# EAGLE design M710-9601 (EAGLE 6.6.0)
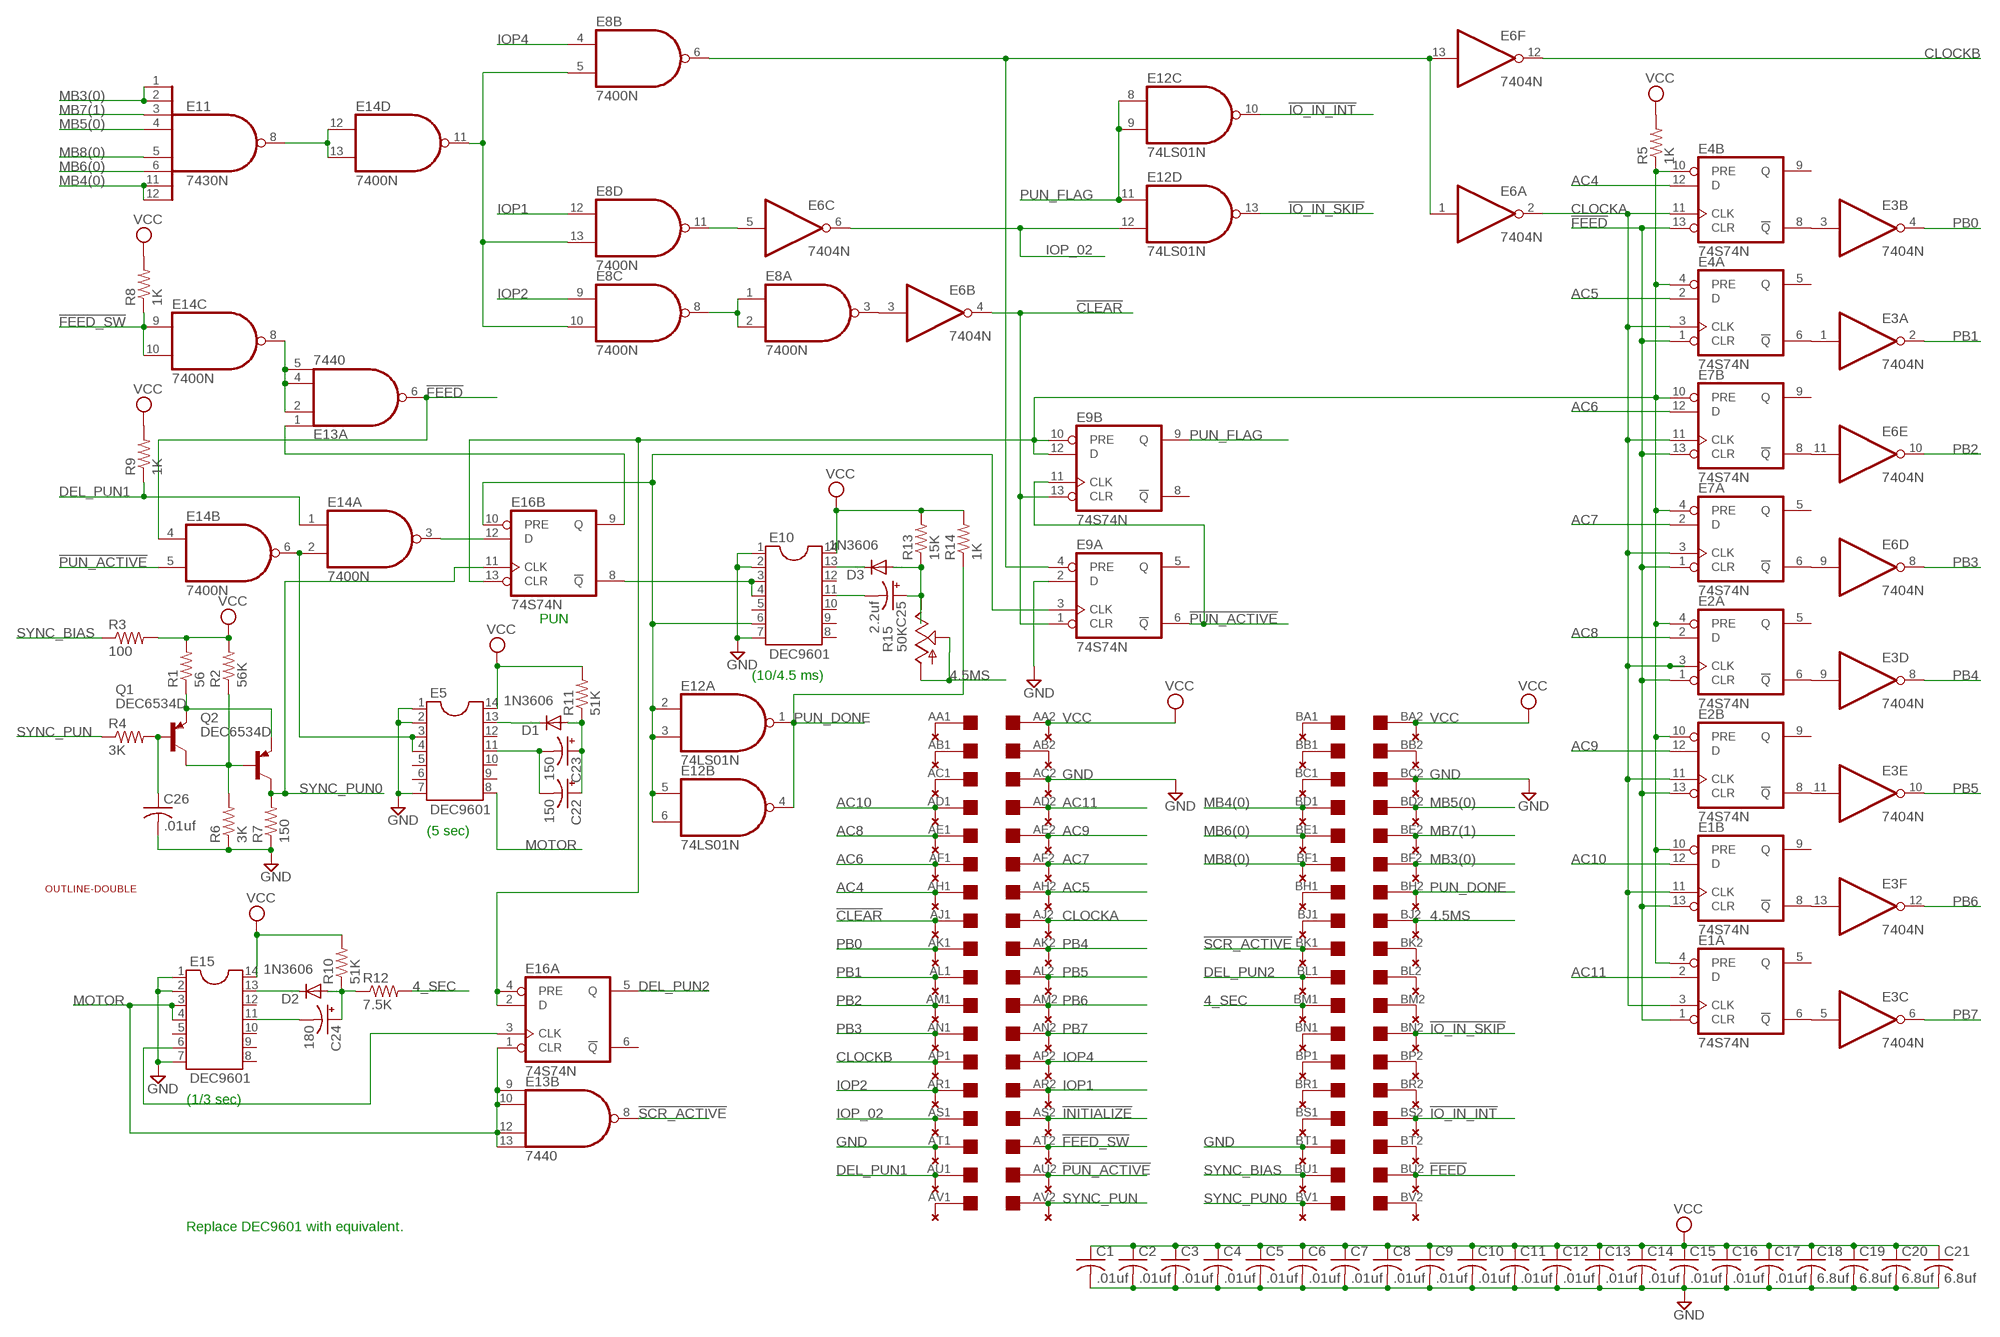
[diagram p0: schematic, sheet 1]

## Parts
C1  .01uf  C-US050-025X075  [C050-025X075]
C2  .01uf  C-US050-025X075  [C050-025X075]
C3  .01uf  C-US050-025X075  [C050-025X075]
C4  .01uf  C-US050-025X075  [C050-025X075]
C5  .01uf  C-US050-025X075  [C050-025X075]
C6  .01uf  C-US050-025X075  [C050-025X075]
C7  .01uf  C-US050-025X075  [C050-025X075]
C8  .01uf  C-US050-025X075  [C050-025X075]
C9  .01uf  C-US050-025X075  [C050-025X075]
C10  .01uf  C-US050-025X075  [C050-025X075]
C11  .01uf  C-US050-025X075  [C050-025X075]
C12  .01uf  C-US050-025X075  [C050-025X075]
C13  .01uf  C-US050-025X075  [C050-025X075]
C14  .01uf  C-US050-025X075  [C050-025X075]
C15  .01uf  C-US050-025X075  [C050-025X075]
C16  .01uf  C-US050-025X075  [C050-025X075]
C17  .01uf  C-US050-025X075  [C050-025X075]
C18  6.8uf  C-US150-054X183  [C150-054X183]
C19  6.8uf  C-US150-054X183  [C150-054X183]
C20  6.8uf  C-US150-054X183  [C150-054X183]
C21  6.8uf  C-US150-054X183  [C150-054X183]
C22  150  CPOL-USE5-8.5  [E5-8,5]
C23  150  CPOL-USE5-8.5  [E5-8,5]
C24  180  CPOL-USE5-8.5  [E5-8,5]
C25  2.2uf  CPOL-USE5-8.5  [E5-8,5]
C26  .01uf  C-US050-025X075  [C050-025X075]
D1  1N3606  1N4004  [DO41-10]
D2  1N3606  1N4004  [DO41-10]
D3  1N3606  1N4004  [DO41-10]
E1  74S74N  [DIL14]
E2  74S74N  [DIL14]
E3  7404N  [DIL14]
E4  74S74N  [DIL14]
E5  DEC9601  DIL14  [DIL14]
E6  7404N  [DIL14]
E7  74S74N  [DIL14]
E8  7400N  [DIL14]
E9  74S74N  [DIL14]
E10  DEC9601  DIL14  [DIL14]
E11  7430N  [DIL14]
E12  74LS01N  [DIL14]
E13  7440  74S20N  [DIL14]
E14  7400N  [DIL14]
E15  DEC9601  DIL14  [DIL14]
E16  74S74N  [DIL14]
Q1  DEC6534D  2N3906  [TO92]
Q2  DEC6534D  2N3906  [TO92]
R1  56  R-US_0207/7  [0207/7]
R2  56K  R-US_0207/7  [0207/7]
R3  100  R-US_0207/7  [0207/7]
R4  3K  R-US_0207/7  [0207/7]
R5  1K  R-US_0207/7  [0207/7]
R6  3K  R-US_0207/7  [0207/7]
R7  150  R-US_0207/7  [0207/7]
R8  1K  R-US_0207/7  [0207/7]
R9  1K  R-US_0207/7  [0207/7]
R10  51K  R-US_0207/7  [0207/7]
R11  51K  R-US_0207/7  [0207/7]
R12  7.5K  R-US_0207/7  [0207/7]
R13  15K  R-US_0207/7  [0207/7]
R14  1K  R-US_0207/7  [0207/7]
R15  50K  TRIM_US-PTSPIN  [PT-SPIN]
U$1  OUTLINE-DOUBLE  [DOUBLE]
U$2  DOUBLE  [EDGE-CON4]
U$5  THRU-HOLE2B  [THRU-HOLEB]
U$7  THRU-HOLE2B  [THRU-HOLEB]

## Nets
4.5MS: R15.A R15.S U$2.BJ2 U$5.J2
4_SEC: R12.2 U$2.BM1 U$5.M1
!CLEAR: E6.4(B:O) E9.1(A:CLR) E9.13(B:CLR) U$2.AJ1 U$7.J1
!FEED: E1.1(A:CLR) E1.13(B:CLR) E2.1(A:CLR) E2.13(B:CLR) E4.1(A:CLR) E4.13(B:CLR) E7.1(A:CLR) E7.13(B:CLR) E13.6(A:O) E14.4(B:I0) U$2.BU2 U$5.U2
!FEED_SW: E14.9(C:I0) E14.10(C:I1) R8.1 U$2.AT2 U$7.T2
!INITIALIZE: U$2.AS2 U$7.S2
!IO_IN_INT: E12.10(C:O) U$2.BS2 U$5.S2
!IO_IN_SKIP: E12.13(D:O) U$2.BN2 U$5.N2
!PUN_ACTIVE: E9.6(A:!Q) E9.11(B:CLK) E14.5(B:I1) U$2.AU2 U$7.U2
!SCR_ACTIVE: E13.8(B:O) U$2.BK1 U$5.K1
AC4: E4.12(B:D) U$2.AH1 U$7.H1
AC5: E4.2(A:D) U$2.AH2 U$7.H2
AC6: E7.12(B:D) U$2.AF1 U$7.F1
AC7: E7.2(A:D) U$2.AF2 U$7.F2
AC8: E2.2(A:D) U$2.AE1 U$7.E1
AC9: E2.12(B:D) U$2.AE2 U$7.E2
AC10: E1.12(B:D) U$2.AD1 U$7.D1
AC11: E1.2(A:D) U$2.AD2 U$7.D2
CLOCKA: E1.3(A:CLK) E1.11(B:CLK) E2.3(A:CLK) E2.11(B:CLK) E4.3(A:CLK) E4.11(B:CLK) E6.2(A:O) E7.3(A:CLK) E7.11(B:CLK) U$2.AJ2 U$7.J2
CLOCKB: E6.12(F:O) U$2.AP1 U$7.P1
DEL_PUN1: E14.1(A:I0) R9.1 U$2.AU1 U$7.U1
DEL_PUN2: E16.5(A:Q) U$2.BL1 U$5.L1
GND: C1.2 C2.2 C3.2 C4.2 C5.2 C6.2 C7.2 C8.2 C9.2 C10.2 C11.2 C12.2 C13.2 C14.2 C15.2 C16.2 C17.2 C18.2 C19.2 C20.2 C21.2 C26.2 E5.1 E5.2 E5.7 E9.2(A:D) E10.1 E10.2 E10.7 E15.1 E15.2 E15.7 R6.1 R7.1 U$2.AC2 U$2.AT1 U$2.BC2 U$2.BT1 U$5.C2 U$5.T1 U$7.C2 U$7.T1
IOP1: E8.12(D:I0) U$2.AR2 U$7.R2
IOP2: E8.9(C:I0) U$2.AR1 U$7.R1
IOP4: E8.4(B:I0) U$2.AP2 U$7.P2
IOP_02: E6.6(C:O) E12.12(D:I1) U$2.AS1 U$7.S1
MB3(0): E11.1(I0) E11.2(I1) U$2.BF2 U$5.F2
MB4(0): E11.11(I6) E11.12(I7) U$2.BD1 U$5.D1
MB5(0): E11.4(I3) U$2.BD2 U$5.D2
MB6(0): E11.6(I5) U$2.BE1 U$5.E1
MB7(1): E11.3(I2) U$2.BE2 U$5.E2
MB8(0): E11.5(I4) U$2.BF1 U$5.F1
MOTOR: E5.8 E13.9(B:I0) E13.10(B:I1) E13.12(B:I2) E13.13(B:I3) E15.3 E15.4 E16.1(A:CLR)
N$1: U$2.AB2 U$7.B2
N$2: E3.3(B:I) E4.8(B:!Q)
N$3: E3.1(A:I) E4.6(A:!Q)
N$4: E6.1(A:I) E6.13(F:I) E8.6(B:O) E9.4(A:PRE)
N$5: E11.8(O) E14.12(D:I0) E14.13(D:I1)
N$6: E6.3(B:I) E8.3(A:O)
N$7: E8.1(A:I0) E8.2(A:I1) E8.8(C:O)
N$8: E8.5(B:I1) E8.10(C:I1) E8.13(D:I1) E14.11(D:O)
N$9: E2.6(A:!Q) E3.9(D:I)
N$10: E2.8(B:!Q) E3.11(E:I)
N$11: E1.8(B:!Q) E3.13(F:I)
N$12: E1.6(A:!Q) E3.5(C:I)
N$13: E6.11(E:I) E7.8(B:!Q)
N$14: E6.9(D:I) E7.6(A:!Q)
N$15: U$2.AV1 U$7.V1
N$16: E6.5(C:I) E8.11(D:O)
N$17: U$2.AC1 U$7.C1
N$18: U$2.AB1 U$7.B1
N$19: Q1.1(C) Q2.2(B) R2.1 R6.2
N$20: U$2.BS1 U$5.S1
N$21: U$2.BR1 U$5.R1
N$22: U$2.BP1 U$5.P1
N$23: U$2.BN1 U$5.N1
N$26: U$2.AA1 U$7.A1
N$27: U$2.BJ1 U$5.J1
N$28: U$2.BH1 U$5.H1
N$29: U$2.BC1 U$5.C1
N$30: U$2.BB1 U$5.B1
N$31: U$2.BA1 U$5.A1
N$32: U$2.BV2 U$5.V2
N$33: U$2.BT2 U$5.T2
N$34: U$2.BR2 U$5.R2
N$35: U$2.BP2 U$5.P2
N$36: Q1.3(E) Q2.3(E) R1.1
N$37: U$2.BM2 U$5.M2
N$38: C26.1 Q1.2(B) R4.2
N$39: U$2.BL2 U$5.L2
N$40: C24.- E15.11
N$41: E13.2(A:I1) E13.4(A:I2) E13.5(A:I3) E14.8(C:O)
N$42: U$2.BK2 U$5.K2
N$43: U$2.BB2 U$5.B2
N$47: E1.4(A:PRE) E1.10(B:PRE) E2.4(A:PRE) E2.10(B:PRE) E4.4(A:PRE) E4.10(B:PRE) E7.4(A:PRE) E7.10(B:PRE) E9.10(B:PRE) E9.12(B:D) E16.2(A:D) E16.4(A:PRE) E16.13(B:CLR) R5.1
N$49: C25.- E10.11
N$53: E13.1(A:I0) E16.9(B:Q)
N$54: E14.3(A:O) E16.12(B:D)
N$55: E5.3 E5.4 E14.2(A:I1) E14.6(B:O)
N$56: C22.- C23.- E5.11
N$57: D1.C E5.13
N$58: C22.+ C23.+ D1.A R11.1
N$59: D2.C E15.13
N$60: C24.+ D2.A R10.1 R12.1
N$61: E15.6 E16.3(A:CLK)
N$63: D3.C E10.13
N$64: C25.+ D3.A R13.1 R15.E
N$65: E10.3 E10.4 E16.8(B:!Q)
N$66: E9.3(A:CLK) E10.6 E12.2(A:I0) E12.3(A:I1) E12.5(B:I0) E12.6(B:I1) E16.10(B:PRE)
PB0: E3.4(B:O) U$2.AK1 U$7.K1
PB1: E3.2(A:O) U$2.AL1 U$7.L1
PB2: E6.10(E:O) U$2.AM1 U$7.M1
PB3: E6.8(D:O) U$2.AN1 U$7.N1
PB4: E3.8(D:O) U$2.AK2 U$7.K2
PB5: E3.10(E:O) U$2.AL2 U$7.L2
PB6: E3.12(F:O) U$2.AM2 U$7.M2
PB7: E3.6(C:O) U$2.AN2 U$7.N2
PUN_DONE: E12.1(A:O) E12.4(B:O) R14.1 U$2.BH2 U$5.H2
PUN_FLAG: E9.9(B:Q) E12.8(C:I0) E12.9(C:I1) E12.11(D:I0)
SYNC_BIAS: R3.1 U$2.BU1 U$5.U1
SYNC_PUN: R4.1 U$2.AV2 U$7.V2
SYNC_PUN0: E16.11(B:CLK) Q2.1(C) R7.2 U$2.BV1 U$5.V1
VCC: C1.1 C2.1 C3.1 C4.1 C5.1 C6.1 C7.1 C8.1 C9.1 C10.1 C11.1 C12.1 C13.1 C14.1 C15.1 C16.1 C17.1 C18.1 C19.1 C20.1 C21.1 E5.14 E10.14 E15.14 R1.2 R2.2 R3.2 R5.2 R8.2 R9.2 R10.2 R11.2 R13.2 R14.2 U$2.AA2 U$2.BA2 U$5.A2 U$7.A2
Unconnected: E1.5(A:Q) E1.9(B:Q) E2.5(A:Q) E2.9(B:Q) E4.5(A:Q) E4.9(B:Q) E5.5 E5.6 E5.9 E5.10 E5.12 E7.5(A:Q) E7.9(B:Q) E9.5(A:Q) E9.8(B:!Q) E10.5 E10.8 E10.9 E10.10 E10.12 E15.5 E15.8 E15.9 E15.10 E15.12 E16.6(A:!Q)

## Notes on the sheet
- PUN
- (10/4.5 ms)
- (5 sec)
- (1/3 sec)
- Replace DEC9601 with equivalent.

## Power pins joined to a net without a drawn wire
GND: E1.7(P:GND) E2.7(P:GND) E3.7(P:GND) E4.7(P:GND) E6.7(P:GND) E7.7(P:GND) E8.7(P:GND) E9.7(P:GND) E11.7(GND) E12.7(P:GND) E13.7(P:GND) E14.7(P:GND) E16.7(P:GND)
VCC: E1.14(P:VCC) E2.14(P:VCC) E3.14(P:VCC) E4.14(P:VCC) E6.14(P:VCC) E7.14(P:VCC) E8.14(P:VCC) E9.14(P:VCC) E11.14(VCC) E12.14(P:VCC) E13.14(P:VCC) E14.14(P:VCC) E16.14(P:VCC)

## Library data of the parts
C1-C21 C26 = rcl:C-US: CAPACITOR, American symbol
C22-C25 = rcl:CPOL-US: POLARIZED CAPACITOR, American symbol
D1-D3 = diode:1N4004: DIODE general purpose rectifier, 1 A
E1 E2 E4 E7 E9 E16 = 74xx-us:74*74: Dual D type positive edge triggered FLIP FLOP, preset and clear
E3 E6 = 74xx-us:74*04: Hex INVERTER
E5 E10 E15 = ic-package:DIL14: Dual In Line / Socket
E8 E14 = 74xx-us:74*00: Quad 2-input NAND gate
E11 = 74xx-us:74*30: 8-input NAND gate
E12 = 74xx-us:74*01: Quad 2-input NAND gate, open collector
E13 = 74xx-us:74*20: Dual 4-input NAND gate
Q1 Q2 = transistor-pnp:2N3906: PNP Transistor
R1-R14 = rcl:R-US_: RESISTOR, American symbol
R15 = pot:TRIM_US-: POTENTIOMETER
U$1 = dec-con:OUTLINE-*: Board outlines for DEC boards.
U$2 = dec-con:DOUBLE: Double-Height DEC board
U$5 U$7 = dec-con:THRU-HOLE2: Thru-Hole addition to double-sided edge connector.

## Board
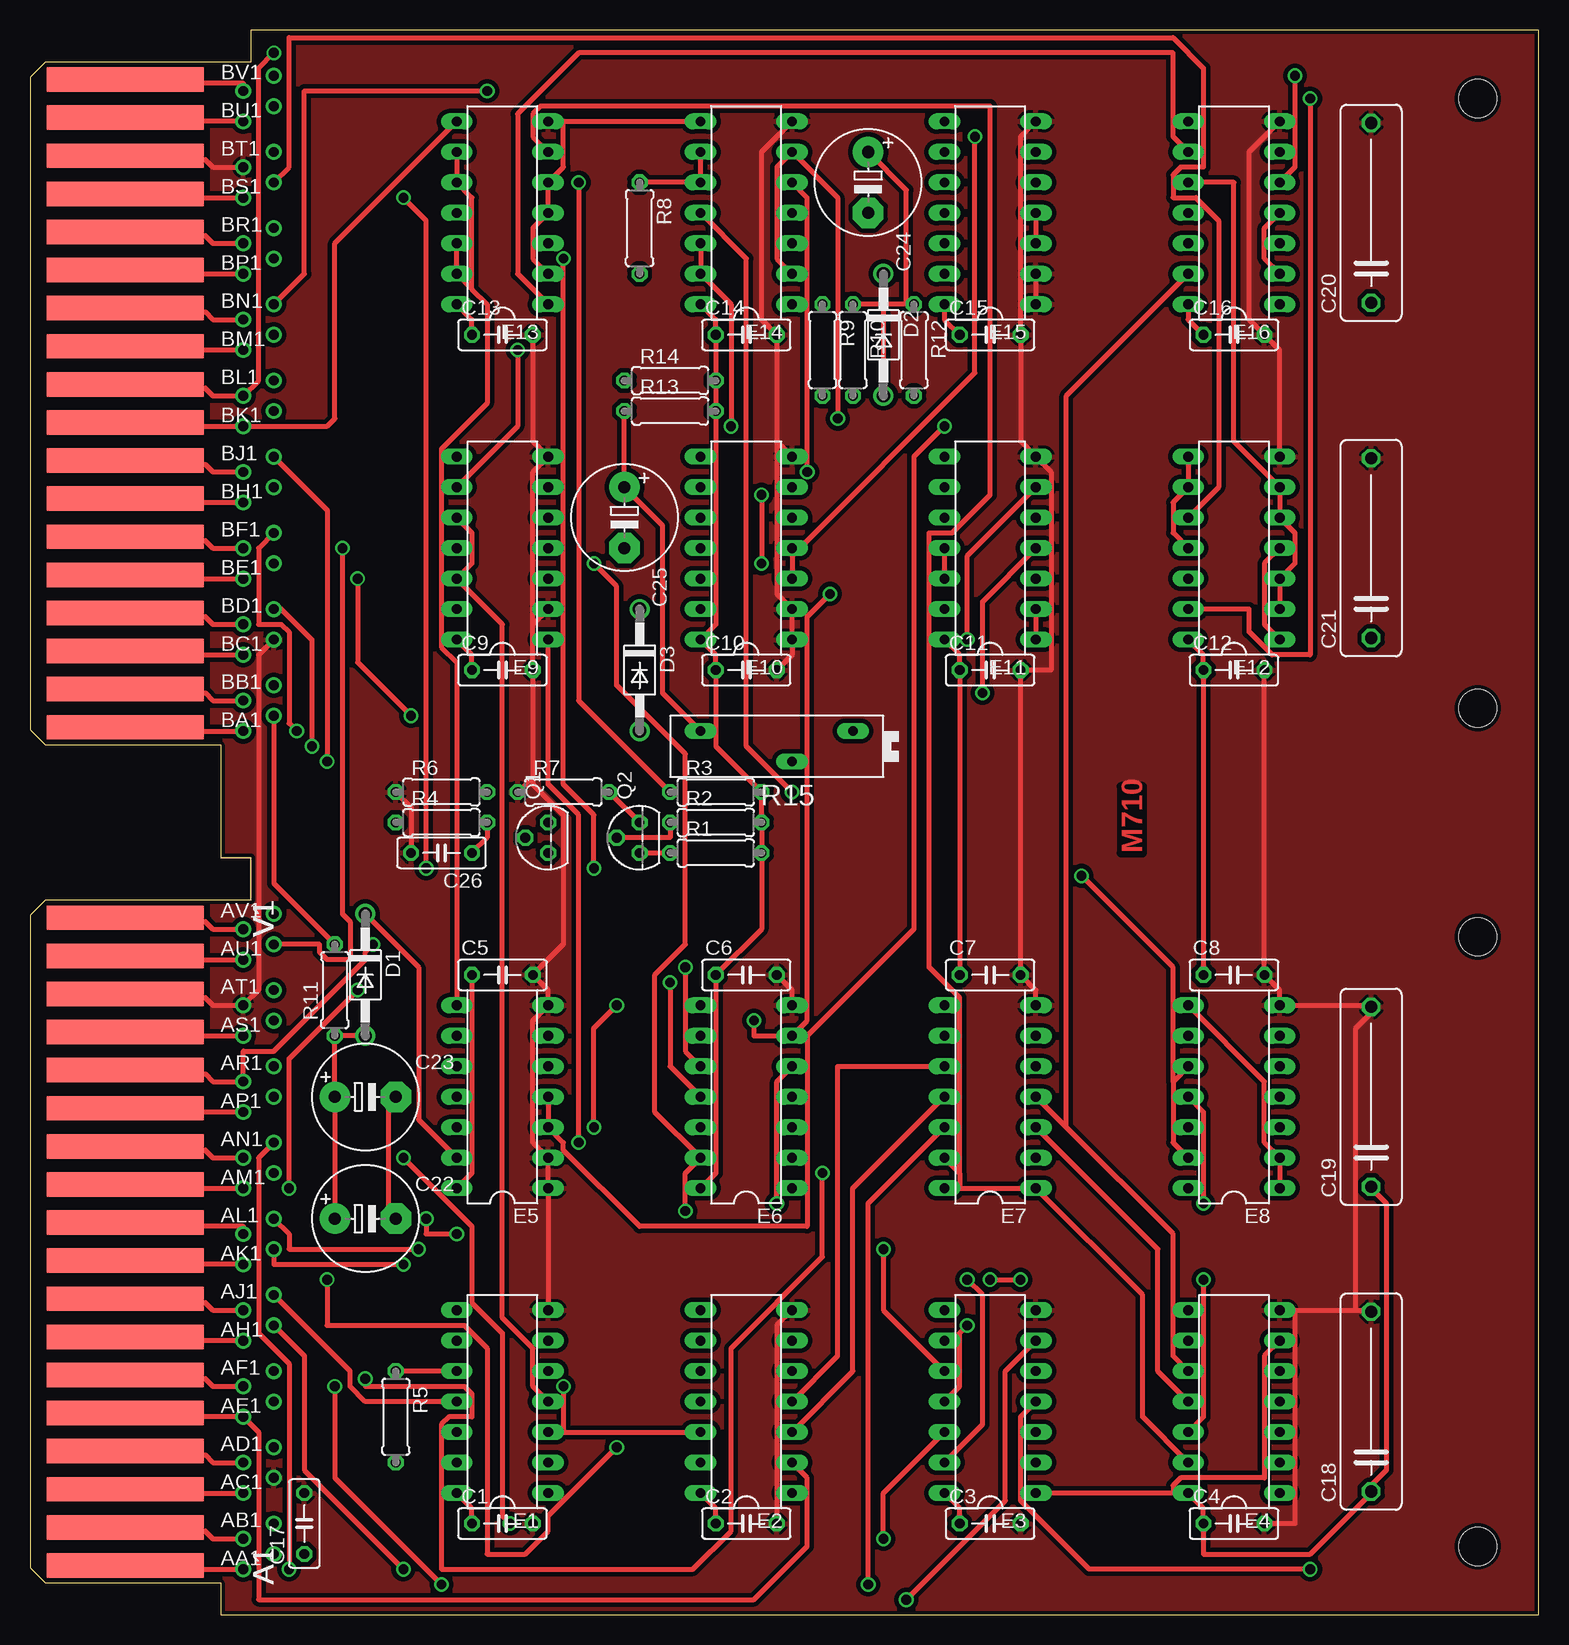
[diagram p1: board, top side]
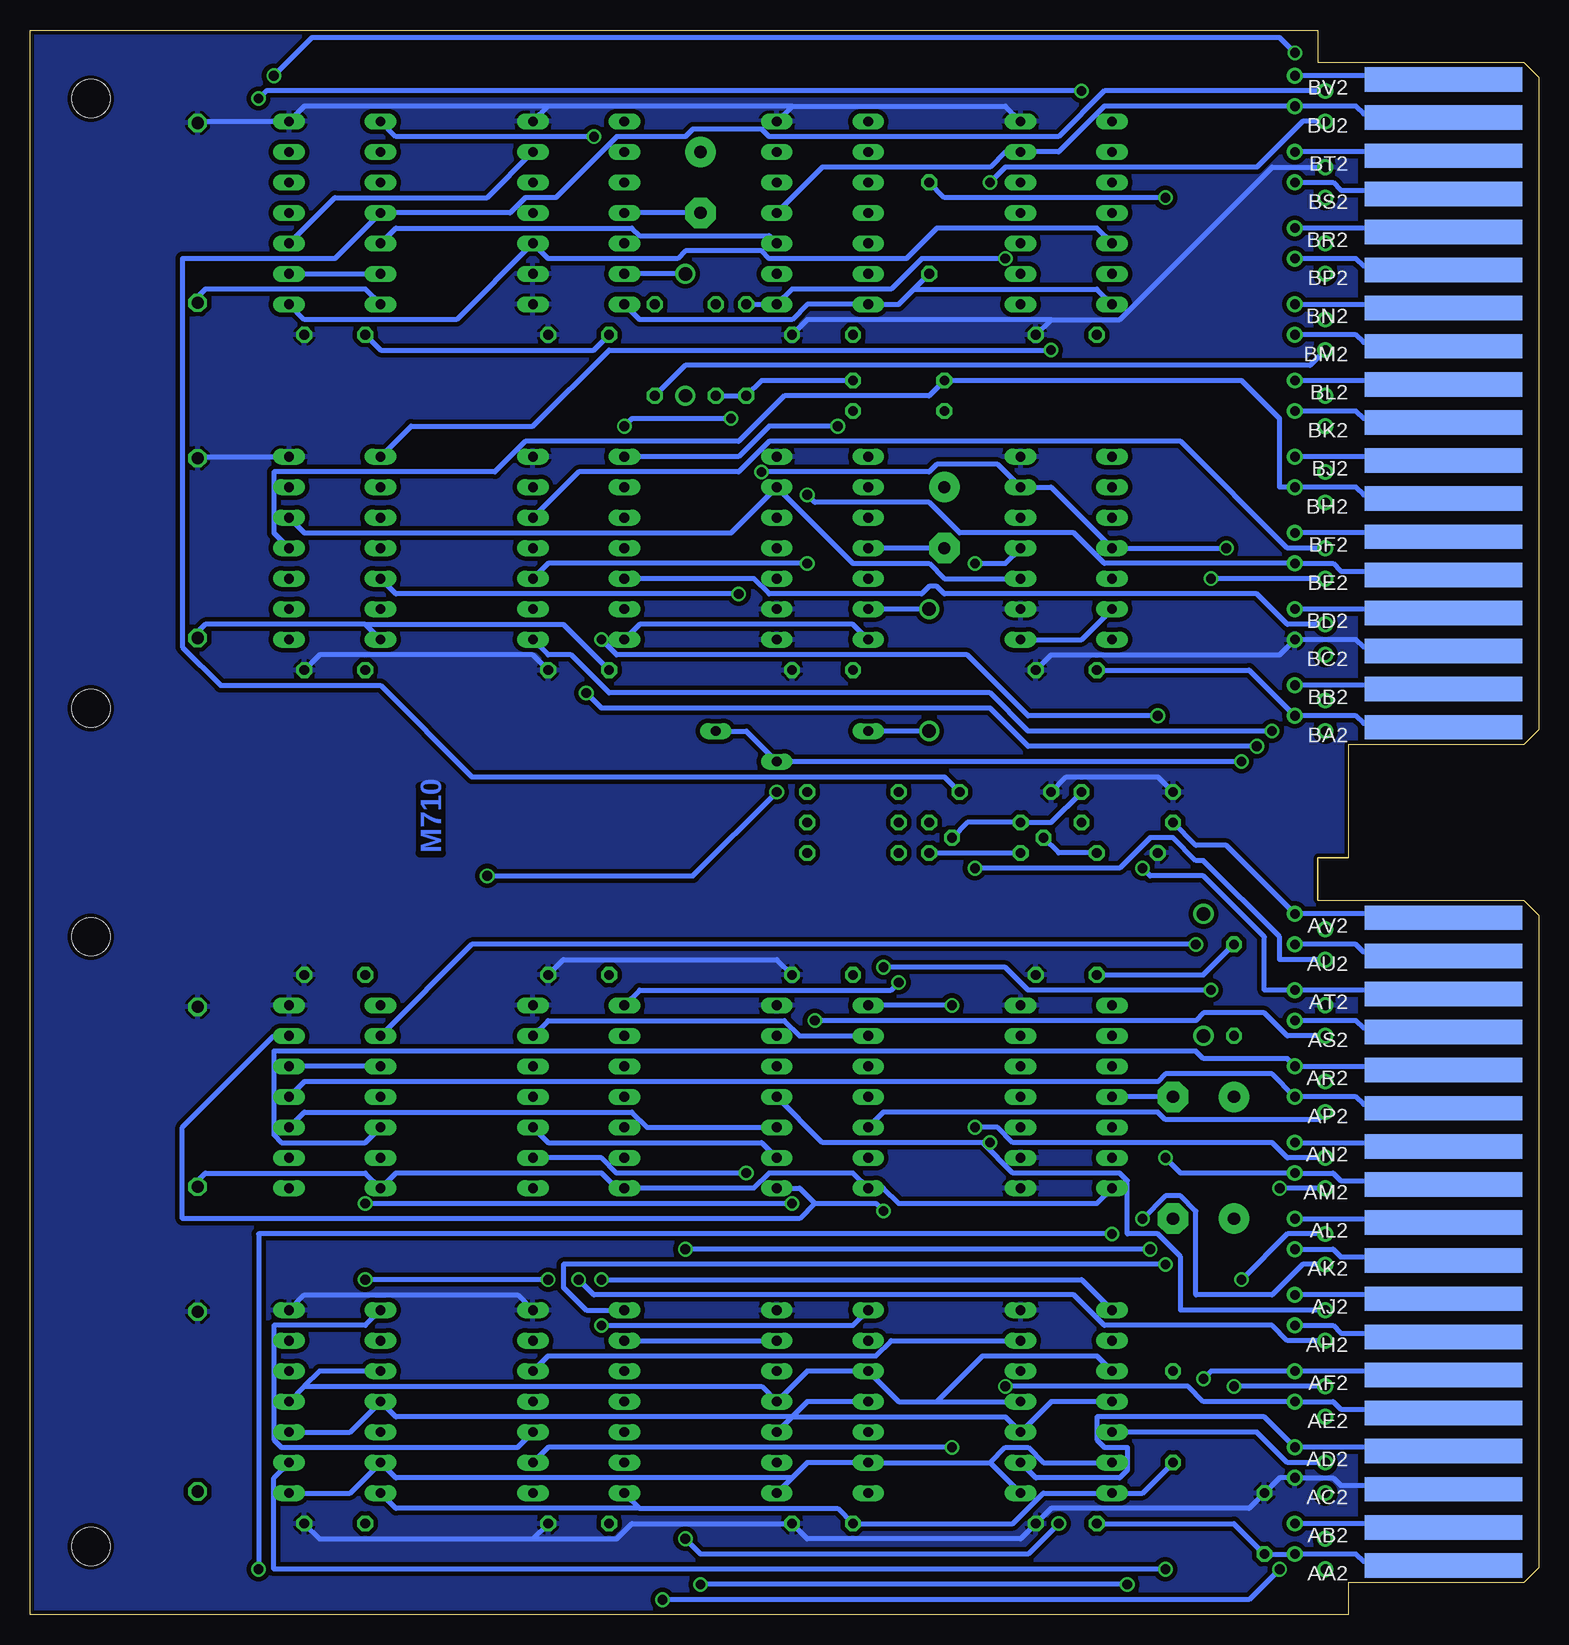
[diagram p2: board, bottom side, seen from below]

Size 125.73 x 132.08 mm. Coordinates in mm from the lower left corner, seen from the top.
Copper layers (1+16): Top 0.035mm / dielectric 1.5mm / Bottom 0.035mm
Design rules "16mils": minimum track width 16mil, minimum drill 32mil, track to track 15mil, track to pad 10mil, pad to pad 10mil, via to via 10mil, smd to smd 10mil, copper to edge 13mil, drill to drill 10mil, minimum pad ring 10mil, minimum via ring 8mil, stop-mask expansion 0mil, vias tented up to drill 0mil, thermal gap 10mil
vRestrict: area 31.8,108 to 41.9,125.7; area 49.5,108 to 59.7,125.7; area 67.3,108 to 77.5,125.7; area 85.1,108 to 95.3,125.7; area 102.9,108 to 113,125.7; area 31.8,80 to 41.9,97.8; area 49.5,80 to 59.7,97.8; area 67.3,80 to 77.5,97.8; area 85.1,80 to 95.3,97.8; area 31.8,34.3 to 41.9,52.1; area 49.5,34.3 to 59.7,52.1; area 67.3,34.3 to 77.5,52.1; area 85.1,34.3 to 95.3,52.1; area 102.9,11.4 to 113,29.2; area 85.1,11.4 to 95.3,29.2; area 49.5,11.4 to 59.7,29.2; area 31.8,11.4 to 41.9,29.2; area 67.3,11.4 to 77.5,29.2

### Footprints (pad centres in the part's own frame; a part is rotated, then mirrored left to right if it is on the bottom)
C050-025X075 = drill 0.813 octagon: 1 -2.54,0; 2 2.54,0
C150-054X183 = drill 1.016 octagon: 1 -7.493,0; 2 7.493,0
E5-8,5 = drill 1.016 pad 2.54: + -2.54,0 | drill 1.016 pad 2.54 octagon: - 2.54,0
DO41-10 = drill 1.118: A 5.08,0; C -5.08,0
DIL14 = drill 0.813 long: 1 -7.62,-3.81; 2 -5.08,-3.81; 3 -2.54,-3.81; 4 0,-3.81; 5 2.54,-3.81; 6 5.08,-3.81; 7 7.62,-3.81; 8 7.62,3.81; 9 5.08,3.81; 10 2.54,3.81; 11 0,3.81; 12 -2.54,3.81; 13 -5.08,3.81; 14 -7.62,3.81
TO92 = drill 0.813 octagon: 1 1.27,0; 2 0,1.905; 3 -1.27,0
0207/7 = drill 0.813 octagon: 1 -3.81,0; 2 3.81,0
PT-SPIN = drill 0.813 long: A -6.35,-1.27; E 6.35,-1.27; S -1.27,1.27
DOUBLE = hole 3.175: 120.65,56.515; 120.65,5.715; 120.65,75.565; 120.65,126.365
EDGE-CON4 = smd 13.106 x 2.032: AA1 7.938,4.128; AB1 7.938,7.303; AC1 7.938,10.477; AD1 7.938,13.652; AE1 7.938,16.828; AF1 7.938,20.003; AH1 7.938,23.177; AJ1 7.938,26.352; AK1 7.938,29.527; AL1 7.938,32.703; AM1 7.938,35.877; AN1 7.938,39.053; AP1 7.938,42.227; AR1 7.938,45.403; AS1 7.938,48.578; AT1 7.938,51.752; AU1 7.938,54.928; AV1 7.938,58.102; BA1 7.938,73.978; BB1 7.938,77.153; BC1 7.938,80.328; BD1 7.938,83.502; BE1 7.938,86.677; BF1 7.938,89.853; BH1 7.938,93.028; BJ1 7.938,96.203; BK1 7.938,99.377; BL1 7.938,102.552; BM1 7.938,105.728; BN1 7.938,108.903; BP1 7.938,112.078; BR1 7.938,115.252; BS1 7.938,118.427; BT1 7.938,121.603; BU1 7.938,124.778; BV1 7.938,127.953 | smd 13.106 x 2.032 bottom: AA2 7.938,4.128; AB2 7.938,7.303; AC2 7.938,10.477; AD2 7.938,13.652; AE2 7.938,16.828; AF2 7.938,20.003; AH2 7.938,23.177; AJ2 7.938,26.352; AK2 7.938,29.527; AL2 7.938,32.703; AM2 7.938,35.877; AN2 7.938,39.053; AP2 7.938,42.227; AR2 7.938,45.403; AS2 7.938,48.578; AT2 7.938,51.752; AU2 7.938,54.928; AV2 7.938,58.102; BA2 7.938,73.978; BB2 7.938,77.153; BC2 7.938,80.328; BD2 7.938,83.502; BE2 7.938,86.677; BF2 7.938,89.853; BH2 7.938,93.028; BJ2 7.938,96.203; BK2 7.938,99.377; BL2 7.938,102.552; BM2 7.938,105.728; BN2 7.938,108.903; BP2 7.938,112.078; BR2 7.938,115.252; BS2 7.938,118.427; BT2 7.938,121.603; BU2 7.938,124.778; BV2 7.938,127.953
THRU-HOLEB = drill 0.813 pad 1.27: A1 17.78,3.81; A2 20.32,5.08; B1 17.78,6.35; B2 20.32,7.62; C1 17.78,10.16; C2 20.32,11.43; D1 17.78,12.7; D2 20.32,13.97; E1 17.78,16.51; E2 20.32,17.78; F1 17.78,19.05; F2 20.32,20.32; H1 17.78,22.86; H2 20.32,24.13; J1 17.78,25.4; J2 20.32,26.67; K1 17.78,29.21; K2 20.32,30.48; L1 17.78,31.75; L2 20.32,33.02; M1 17.78,35.56; M2 20.32,36.83; N1 17.78,38.1; N2 20.32,39.37; P1 17.78,41.91; P2 20.32,43.18; R1 17.78,44.45; R2 20.32,45.72; S1 17.78,48.26; S2 20.32,49.53; T1 17.78,50.8; T2 20.32,52.07; U1 17.78,54.61; U2 20.32,55.88; V1 17.78,57.15; V2 20.32,58.42

### Placement (x,y rotation side)
C1  39.37,7.62 0 top
C2  59.69,7.62 0 top
C3  80.01,7.62 0 top
C4  100.33,7.62 0 top
C5  39.37,53.34 0 top
C6  59.69,53.34 0 top
C7  80.01,53.34 0 top
C8  100.33,53.34 0 top
C9  39.37,78.74 0 top
C10  59.69,78.74 0 top
C11  80.01,78.74 0 top
C12  100.33,78.74 0 top
C13  39.37,106.68 0 top
C14  59.69,106.68 0 top
C15  80.01,106.68 0 top
C16  100.33,106.68 0 top
C17  22.86,7.62 90 top
C18  111.76,17.78 90 top
C19  111.76,43.18 90 top
C20  111.76,116.84 90 top
C21  111.76,88.9 90 top
C22  27.94,33.02 0 top
C23  27.94,43.18 0 top
C24  69.85,119.38 270 top
C25  49.53,91.44 270 top
C26  34.29,63.5 180 top
D1  27.94,53.34 270 top
D2  71.12,106.68 270 top
D3  50.8,78.74 270 top
E1  39.37,17.78 90 top
E2  59.69,17.78 90 top
E3  80.01,17.78 90 top
E4  100.33,17.78 90 top
E5  39.37,43.18 90 top
E6  59.69,43.18 90 top
E7  80.01,43.18 90 top
E8  100.33,43.18 90 top
E9  39.37,88.9 90 top
E10  59.69,88.9 90 top
E11  80.01,88.9 90 top
E12  100.33,88.9 90 top
E13  39.37,116.84 90 top
E14  59.69,116.84 90 top
E15  80.01,116.84 90 top
E16  100.33,116.84 90 top
Q1  43.18,64.77 90 top
Q2  50.8,64.77 90 top
R1  57.15,63.5 0 top
R2  57.15,66.04 0 top
R3  57.15,68.58 0 top
R4  34.29,66.04 0 top
R5  30.48,16.51 270 top
R6  34.29,68.58 0 top
R7  44.45,68.58 0 top
R8  50.8,115.57 270 top
R9  66.04,105.41 270 top
R10  68.58,105.41 270 top
R11  25.4,52.07 90 top
R12  73.66,105.41 270 top
R13  53.34,100.33 0 top
R14  53.34,102.87 0 top
R15  62.23,72.39 180 top
U$1  0,0 0 top
U$2  0,0 0 top
U$5  0,69.85 0 top
U$7  0,0 0 top

### Tracks (layer width: path | path; a pad name or v marks a point on that pad's centre or on a via)
4.5MS  (via drill 0.81)
  Top 0.406: v24.77,71.12 24.77,92.08 U$5.J2
  Bottom 0.406: R15.A 66.04,73.66 R15.S v24.77,71.12 | U$5.J2 8.26,96.52 U$2.BJ2
4_SEC
  Top 0.406: U$5.M1 8.26,105.41 U$2.BM1
  Bottom 0.406: R12.2 71.12,104.14 19.05,104.14 U$5.M1
!CLEAR  (via drill 0.81)
  Top 0.406: U$7.J1 15.24,25.4 14.61,26.04 8.26,26.04 U$2.AJ1 | E9.1 43.18,69.22 45.72,66.67 v45.72,39.37
  Bottom 0.406: E9.13 38.1,81.28 E9.1 | E6.4 59.69,39.37 46.36,39.37 | 46.36,39.37 43.82,36.83 34.93,36.83 34.29,36.2 34.29,31.75 31.75,31.75 29.85,29.84 29.85,25.4 U$7.J1 | 46.36,39.37 v45.72,39.37
!FEED
  Top 0.406: 77.47,36.83 77.47,35.56 E7.1 92.71,26.67 92.71,16.51 E4.13 | E7.13 77.47,36.83 | E13.6 41.91,123.19 41.91,125.09 42.55,125.73 80.01,125.73 80.01,93.34 76.84,90.17 74.93,90.17 74.93,53.98 77.47,51.44 77.47,36.83
  Bottom 0.406: U$2.BU2 8.26,125.09 14.61,125.09 15.24,125.73 U$5.U2 36.2,125.73 40.01,121.92 E13.6 44.45,121.92 45.72,120.65 59.69,120.65 E14.4 | E4.1 99.06,10.16 E4.13 95.25,11.43 62.23,11.43 | 45.72,12.7 E1.1 | 45.72,12.7 E2.13 60.96,12.7 62.23,11.43 | 62.23,11.43 E2.1 | E1.13 41.28,12.7 42.55,13.97 44.45,13.97 45.72,12.7
!FEED_SW  (via drill 0.81)
  Top 0.406: R8.1 E14.10 E14.9 | v31.12,118.11 33.02,116.2 v33.02,62.23
  Bottom 0.406: U$2.AT2 8.26,52.07 U$7.T2 22.86,52.07 22.86,56.52 27.94,61.59 32.39,61.59 v33.02,62.23 | R8.1 49.53,118.11 v31.12,118.11
!INITIALIZE
  Bottom 0.406: U$7.S2 15.24,49.53 14.61,48.9 8.26,48.9 U$2.AS2
!IO_IN_INT
  Top 0.406: E12.10 99.06,93.98 99.06,116.2 97.16,118.11 95.25,118.11 95.25,120.02 95.89,120.65 97.79,120.65 97.79,128.91 95.25,131.44 21.59,131.44 21.59,120.65 U$5.S2
  Bottom 0.406: U$5.S2 17.15,119.38 16.51,118.75 8.26,118.75 U$2.BS2
!IO_IN_SKIP  (via drill 0.81)
  Top 0.406: E12.13 101.6,83.82 101.6,81.92 103.51,80.01 106.68,80.01 v106.68,126.36 | v38.1,127 22.86,127 22.86,111.76 U$5.N2
  Bottom 0.406: v106.68,126.36 106.05,127 v38.1,127 | U$5.N2 8.26,109.22 U$2.BN2
!PUN_ACTIVE  (via drill 0.81)
  Top 0.406: E14.5 64.77,118.11 v64.77,95.25 | U$7.U2 24.13,55.88 24.13,55.24 24.77,54.61 26.67,54.61 26.67,57.78 26.04,58.42 v26.04,88.9
  Bottom 0.406: U$7.U2 15.24,55.88 14.61,55.24 8.26,55.24 U$2.AU2 | v64.77,95.25 50.8,95.25 50.17,95.89 45.09,95.89 E9.6 40.64,93.98 E9.11 v26.04,88.9
!SCR_ACTIVE
  Top 0.406: U$2.BK1 8.26,99.06 U$5.K1 24.77,99.06 25.4,99.69 25.4,114.3 E13.8
AC4  (via drill 0.81)
  Top 0.406: E4.12 97.79,16.51 v97.79,27.94 | v80.01,27.94 v82.55,27.94 | U$7.H1 8.26,22.86 U$2.AH1
  Bottom 0.406: v82.55,27.94 v97.79,27.94 | v80.01,27.94 78.74,26.67 38.74,26.67 36.2,24.13 22.23,24.13 20.96,22.86 U$7.H1
AC5  (via drill 0.81)
  Top 0.406: v31.12,3.81 22.86,12.06 22.86,21.59 U$7.H2
  Bottom 0.406: E4.2 105.41,11.43 105.41,3.81 v31.12,3.81 | U$7.H2 17.15,24.13 16.51,23.5 8.26,23.5 U$2.AH2
AC6  (via drill 0.81)
  Top 0.406: U$7.F1 15.24,19.05 14.61,19.68 8.26,19.68 U$2.AF1 | E7.12 69.85,34.29 v69.85,2.54 | v34.29,2.54 25.4,11.43 v25.4,19.05
  Bottom 0.406: v34.29,2.54 v69.85,2.54 | U$7.F1 v25.4,19.05
AC7  (via drill 0.81)
  Top 0.406: v66.04,36.83 66.04,29.84 58.42,22.23 58.42,6.99 55.25,3.81 34.29,3.81 34.29,15.88 34.93,16.51 36.83,16.51 36.83,18.41 36.2,19.05 27.94,19.05 v27.94,19.68
  Bottom 0.406: U$2.AF2 8.26,20.32 U$7.F2 27.31,20.32 v27.94,19.68 | E7.2 78.11,38.1 76.84,36.83 v66.04,36.83
AC8
  Top 0.406: E2.2 64.77,11.43 64.77,5.71 60.33,1.27 19.05,1.27 19.05,15.24 U$7.E1 8.26,16.51 U$2.AE1
AC9  (via drill 0.81)
  Top 0.406: E2.12 44.45,15.24 v44.45,19.05
  Bottom 0.406: v44.45,19.05 29.21,19.05 27.94,17.78 U$7.E2 17.15,17.78 16.51,17.14 8.26,17.14 U$2.AE2
AC10
  Top 0.406: U$7.D1 15.24,12.7 14.61,13.34 8.26,13.34 U$2.AD1
  Bottom 0.406: E1.12 23.5,15.24 20.96,12.7 U$7.D1
AC11
  Bottom 0.406: E1.2 41.91,11.43 34.93,11.43 34.29,12.06 34.29,13.97 36.2,13.97 36.83,14.61 36.83,16.51 22.86,16.51 U$7.D2 8.26,13.97 U$2.AD2
CLOCKA
  Top 0.406: E7.11 68.58,35.56 68.58,20.32 E2.3 | E7.3 93.98,30.48 93.98,20.32 E4.11 | U$7.J2 26.67,20.32 26.67,19.05 27.94,17.78 E1.11
  Bottom 0.406: U$7.J2 8.26,26.67 U$2.AJ2 | E6.2 64.77,39.37 82.55,39.37 E7.3 | E4.3 99.06,15.24 E4.11 95.25,16.51 62.23,16.51 | E1.11 40.64,17.78 E1.3 44.45,16.51 62.23,16.51 | 62.23,16.51 60.96,17.78 E2.11 | 62.23,16.51 E2.3
CLOCKB
  Top 0.406: U$7.P1 8.26,41.91 U$2.AP1
  Bottom 0.406: E6.12 54.61,41.91 31.75,41.91 31.12,41.27 18.42,41.27 U$7.P1
DEL_PUN1  (via drill 0.81)
  Top 0.406: U$7.U1 8.26,54.61 U$2.AU1 | v44.45,113.03 44.45,69.22 46.99,66.67 v46.99,62.23
  Bottom 0.406: R9.1 E14.1 62.23,110.49 53.98,110.49 51.44,113.03 v44.45,113.03 | v46.99,62.23 34.93,62.23 32.39,64.77 30.48,64.77 28.58,62.87 27.94,62.87 21.59,56.52 21.59,54.61 U$7.U1
DEL_PUN2  (via drill 0.81)
  Top 0.406: U$2.BL1 8.26,102.23 14.61,102.23 15.24,101.6 U$5.L1 19.05,102.87 19.05,128.91 v20.32,130.18 | E16.5 105.41,120.65 v105.41,128.27
  Bottom 0.406: v105.41,128.27 102.24,131.44 21.59,131.44 v20.32,130.18
GND
  Top 0.406: C2.2 62.23,24.13 E2.7 | C12.2 C8.2 104.14,52.07 E8.7 111.76,50.8 C19.2 111.76,50.16 110.49,48.9 110.49,25.4 | E4.7 105.41,25.4 | 105.41,25.4 110.49,25.4 | 110.49,25.4 111.76,25.4 C18.2 | C4.2 105.41,7.62 105.41,25.4 | C6.2 63.5,52.07 E6.7 | E7.7 83.82,52.07 C7.2 C11.2 85.09,78.74 85.09,95.25 E11.7 82.55,97.79 C15.2 82.55,109.22 | E12.7 104.14,105.41 C16.2 101.6,107.95 101.6,121.92 E16.7 | E15.2 E15.1 82.55,109.22 | E15.7 82.55,123.19 82.55,109.22 | C10.2 63.5,80.01 E10.1 E10.2 62.23,85.09 62.23,97.79 | 62.23,97.79 E10.7 | 62.23,97.79 C14.2 60.96,107.95 60.96,121.92 E14.7 | U$2.AT1 8.26,51.44 14.61,51.44 15.24,50.8 U$7.T1 19.05,52.07 19.05,80.01 U$5.C2 | U$5.T1 15.24,120.65 14.61,121.28 8.26,121.28 U$2.BT1 | E1.7 E5.1 E5.2 41.91,39.37 41.91,49.53 E5.7 43.18,52.07 C5.2 44.45,55.88 44.45,66.67 41.91,69.22 41.91,69.85 | C13.2 41.91,97.79 E9.7 41.91,95.25 41.91,82.55 | C26.2 31.75,67.31 R6.1 | 41.91,69.85 R7.1 | 41.91,69.85 C9.2 41.91,82.55 | 41.91,82.55 E9.2
  Bottom 0.406: U$2.AC2 8.26,10.79 16.51,10.79 17.15,11.43 U$7.C2 21.59,11.43 C17.2 24.13,8.89 40.64,8.89 C1.2 43.18,6.35 60.96,6.35 C2.2 75.57,7.62 76.84,6.35 83.82,6.35 | 83.82,6.35 C3.2 | 83.82,6.35 101.6,6.35 C4.2 | E3.7 85.09,26.67 102.87,26.67 E4.7 | C6.2 63.5,54.61 81.28,54.61 C7.2 | C20.2 111.76,124.46 E16.7 102.87,125.73 82.55,125.73 | E12.7 111.76,96.52 C21.2 | E13.7 44.45,125.73 62.23,125.73 | E14.7 62.23,125.73 | 82.55,125.73 E15.7 | 62.23,125.73 82.55,125.73 | U$2.BC2 8.26,80.64 14.61,80.64 15.24,81.28 U$5.C2 21.59,80.01 40.64,80.01 C9.2 | R6.1 31.75,69.85 39.37,69.85 R7.1 | U$5.T1 22.23,120.65 34.93,107.95 40.64,107.95 | C13.2 40.64,107.95 | C14.2 60.96,107.95 40.64,107.95 | C12.2 101.6,80.01 83.82,80.01 C11.2
  pour Bottom (isolate 0.254): 125.73,132.08 125.73,0 15.24,0 15.24,132.08
  pour Top (isolate 0.254): 15.24,132.08 125.73,132.08 125.73,0 15.24,0
IOP1
  Bottom 0.406: E8.12 97.79,39.37 104.78,39.37 105.41,40.01 105.41,46.99 28.58,46.99 27.94,46.35 20.96,46.35 U$7.R2 8.26,45.72 U$2.AR2
IOP2  (via drill 0.81)
  Top 0.406: U$2.AR1 8.26,45.09 14.61,45.09 15.24,44.45 U$7.R1 17.78,46.99 20.32,46.99 27.94,54.61 27.94,55.24 v28.58,55.88
  Bottom 0.406: E8.9 88.9,55.88 v28.58,55.88
IOP4
  Bottom 0.406: U$2.AP2 8.26,42.55 14.61,42.55 15.24,43.18 U$7.P2 22.23,45.09 31.12,45.09 31.75,44.45 102.87,44.45 E8.4
IOP_02  (via drill 0.81)
  Top 0.406: U$7.S1 8.26,48.26 U$2.AS1 | v60.33,49.53 60.33,48.26 E6.6 64.77,49.53 64.77,83.19 v66.68,85.09
  Bottom 0.406: v60.33,49.53 28.58,49.53 27.94,50.16 22.86,50.16 20.96,48.26 U$7.S1 | E12.12 95.25,85.09 v66.68,85.09
MB3(0)  (via drill 0.81)
  Top 0.406: E11.2 E11.1 | v22.23,73.66 21.59,74.3 21.59,81.92 20.96,82.55 19.05,82.55 19.05,88.9 U$5.F2
  Bottom 0.406: U$5.F2 8.26,90.17 U$2.BF2 | E11.1 82.55,80.01 80.65,80.01 77.47,76.83 45.72,76.83 42.55,73.66 v22.23,73.66
MB4(0)
  Top 0.406: E11.11 E11.12 | U$5.D1 15.24,82.55 14.61,83.19 8.26,83.19 U$2.BD1
  Bottom 0.406: E11.12 65.41,86.36 64.14,85.09 51.44,85.09 50.8,85.72 50.17,85.72 49.53,85.09 23.5,85.09 20.96,82.55 U$5.D1
MB5(0)  (via drill 0.81)
  Top 0.406: E11.4 79.38,84.45 v79.38,76.83 | v23.5,72.39 23.5,81.28 20.96,83.82 U$5.D2
  Bottom 0.406: U$5.D2 8.26,83.82 U$2.BD2 | v79.38,76.83 78.11,75.56 45.72,75.56 42.55,72.39 v23.5,72.39
MB6(0)  (via drill 0.81)
  Top 0.406: U$5.E1 8.26,86.36 U$2.BE1 | E11.6 78.11,88.27 v78.11,81.28 | v31.75,74.93 27.31,79.38 v27.31,86.36
  Bottom 0.406: v78.11,81.28 76.84,80.01 47.63,80.01 42.55,74.93 v31.75,74.93 | U$5.E1 v27.31,86.36
MB7(1)  (via drill 0.81)
  Top 0.406: v60.96,93.34 v60.96,87.63
  Bottom 0.406: E11.3 82.55,87.63 v60.96,87.63 | v60.96,93.34 60.33,92.71 50.8,92.71 48.26,90.17 38.74,90.17 36.2,87.63 U$5.E2 17.15,87.63 16.51,87 8.26,87 U$2.BE2
MB8(0)
  Top 0.406: U$5.F1 15.24,88.9 14.61,89.53 8.26,89.53 U$2.BF1
  Bottom 0.406: E11.5 80.01,95.25 66.68,95.25 64.14,97.79 29.85,97.79 20.96,88.9 U$5.F1
MOTOR
  Top 0.406: E15.4 E15.3 | E13.9 E13.10 36.83,118.11 36.83,110.49 | E5.8 35.56,79.38 34.29,80.64 34.29,97.16 38.1,100.97 38.1,109.22 36.83,110.49 | 36.83,110.49 E13.13 E13.12
  Bottom 0.406: E16.1 102.87,107.95 90.17,107.95 E15.3 82.55,113.03 71.76,113.03 71.12,113.67 64.77,113.67 64.14,113.03 52.71,113.03 50.17,115.57 36.83,115.57 E13.12
N$1
  Bottom 0.406: U$7.B2 8.26,7.62 U$2.AB2
N$2
  Bottom 0.406: E3.3 85.09,13.97 104.78,13.97 105.41,14.61 105.41,24.13 97.79,24.13 E4.8
N$3
  Top 0.406: E3.1 95.25,10.16 95.25,10.79 95.89,11.43 102.87,11.43 102.87,21.59 E4.6
N$4  (via drill 0.81)
  Top 0.406: v54.61,33.66 54.61,36.83 E6.13 52.07,41.91 52.07,53.34 54.61,55.88 54.61,71.75 48.9,77.47 48.9,85.72 v46.99,87.63
  Bottom 0.406: v54.61,33.66 55.25,34.29 60.33,34.29 | 60.33,34.29 61.6,35.56 E6.1 | E9.4 44.45,87.63 v46.99,87.63 | E8.6 105.41,48.26 113.03,40.64 113.03,33.02 61.6,33.02 60.33,34.29
N$5  (via drill 0.81)
  Top 0.406: E14.12 E14.13 58.42,109.22 v58.42,99.06
  Bottom 0.406: E11.8 66.68,96.52 64.14,99.06 v58.42,99.06
N$6
  Bottom 0.406: E6.3 74.3,40.64 75.57,41.91 102.87,41.91 E8.3
N$7
  Top 0.406: E8.1 E8.2 102.87,39.37 102.87,44.45 E8.8
N$8  (via drill 0.81)
  Top 0.406: E8.13 95.25,39.37 95.25,44.45 | E8.10 95.25,44.45 | E14.11 59.69,113.03 59.69,72.39 v63.5,68.58 | v87.63,61.59 95.25,53.98 95.25,44.45
  Bottom 0.406: E8.10 E8.5 | v63.5,68.58 70.49,61.59 v87.63,61.59
N$9
  Bottom 0.406: E3.9 E2.6
N$10  (via drill 0.81)
  Top 0.406: v78.11,24.13 77.47,23.5 77.47,19.05 E3.11
  Bottom 0.406: E2.8 57.15,24.13 v78.11,24.13
N$11  (via drill 0.81)
  Top 0.406: v78.11,27.94 79.38,26.67 79.38,15.88 E3.13
  Bottom 0.406: E1.8 38.1,27.94 v78.11,27.94
N$12
  Bottom 0.406: E1.6 53.98,22.86 55.25,21.59 82.55,21.59 E3.5
N$13  (via drill 0.81)
  Top 0.406: E6.11 53.34,45.72 v53.34,52.7
  Bottom 0.406: v53.34,52.7 53.98,52.07 74.93,52.07 E7.8
N$14
  Bottom 0.406: E6.9 61.6,48.26 62.87,49.53 82.55,49.53 E7.6
N$15
  Top 0.406: U$7.V1 15.24,57.15 14.61,57.78 8.26,57.78 U$2.AV1
N$16  (via drill 0.81)
  Top 0.406: E6.5 62.23,44.45 v62.23,34.29 | v97.79,34.29 97.79,41.91 E8.11
  Bottom 0.406: v97.79,34.29 v62.23,34.29
N$17
  Top 0.406: U$7.C1 8.26,10.16 U$2.AC1
N$18
  Top 0.406: U$7.B1 15.24,6.35 14.61,6.99 8.26,6.99 U$2.AB1
N$19
  Top 0.406: Q2.2 53.34,64.77 R2.1
  Bottom 0.406: R6.2 40.64,66.04 Q1.1 47.63,66.04 Q2.2
N$20
  Top 0.406: U$5.S1 8.26,118.11 U$2.BS1
N$21
  Top 0.406: U$5.R1 15.24,114.3 14.61,114.94 8.26,114.94 U$2.BR1
N$22
  Top 0.406: U$5.P1 8.26,111.76 U$2.BP1
N$23
  Top 0.406: U$5.N1 15.24,107.95 14.61,108.58 8.26,108.58 U$2.BN1
N$26
  Top 0.406: U$7.A1 8.26,3.81 U$2.AA1
N$27
  Top 0.406: U$5.J1 15.24,95.25 14.61,95.89 8.26,95.89 U$2.BJ1
N$28
  Top 0.406: U$5.H1 8.26,92.71 U$2.BH1
N$29
  Top 0.406: U$5.C1 8.26,80.01 U$2.BC1
N$30
  Top 0.406: U$5.B1 15.24,76.2 14.61,76.83 8.26,76.83 U$2.BB1
N$31
  Top 0.406: U$5.A1 8.26,73.66 U$2.BA1
N$32
  Bottom 0.406: U$5.V2 8.26,128.27 U$2.BV2
N$33
  Bottom 0.406: U$5.T2 8.26,121.92 U$2.BT2
N$34
  Bottom 0.406: U$5.R2 8.26,115.57 U$2.BR2
N$35
  Bottom 0.406: U$5.P2 15.24,113.03 14.61,112.39 8.26,112.39 U$2.BP2
N$36
  Top 0.406: Q2.3 R1.1
  Bottom 0.406: Q2.3 Q1.3
N$37
  Bottom 0.406: U$5.M2 15.24,106.68 14.61,106.05 8.26,106.05 U$2.BM2
N$38
  Top 0.406: C26.1 38.1,64.77 R4.2
  Bottom 0.406: Q1.2 40.01,63.5 C26.1
N$39
  Bottom 0.406: U$5.L2 8.26,102.87 U$2.BL2
N$40
  Bottom 0.406: C24.- E15.11
N$41
  Top 0.406: E13.2 41.91,113.03 41.91,115.57 E13.4 E13.5 44.45,120.65 44.45,124.46 E14.8
N$42
  Bottom 0.406: U$5.K2 15.24,100.33 14.61,99.69 8.26,99.69 U$2.BK2
N$43
  Bottom 0.406: U$5.B2 8.26,77.47 U$2.BB2
N$47
  Top 0.406: E9.10 36.83,90.17 36.83,87.63 E9.12 39.37,82.55 39.37,24.77 41.91,22.23 41.91,19.05 E1.4 | E1.10 R5.1 | E7.10 67.31,45.72 67.31,21.59 E2.4 | E16.4 102.87,115.57 102.87,113.03 E16.2 | 86.36,40.64 95.25,31.75 95.25,21.59 E4.10 | 86.36,40.64 E7.4 | E16.13 86.36,101.6 86.36,40.64
  Bottom 0.406: 50.17,17.78 53.34,17.78 E2.10 60.96,20.32 E2.4 64.77,19.05 102.87,19.05 | 50.17,17.78 E1.4 | E1.10 36.83,21.59 46.36,21.59 50.17,17.78 | E16.2 E16.13 | 102.87,19.05 101.6,20.32 E4.10 | 102.87,19.05 E4.4
N$49
  Bottom 0.406: C25.- E10.11
N$53
  Top 0.406: E13.1 40.64,111.76 40.64,125.09 45.72,130.18 95.25,130.18 95.25,123.19 E16.9
N$54
  Bottom 0.406: E14.3 64.14,114.94 74.93,114.94 75.57,115.57 95.25,115.57 E16.12
N$55  (via drill 0.81)
  Top 0.406: E5.4 E5.3 44.45,39.37 44.45,38.73 50.8,32.38 64.77,32.38 64.77,48.26 73.66,57.15 73.66,96.52 v76.2,99.06 | E14.2 62.23,113.03 62.23,120.65 E14.6 67.31,118.11 v67.31,99.69
  Bottom 0.406: v76.2,99.06 75.57,99.69 v67.31,99.69
N$56
  Top 0.406: C22.- 29.85,33.66 29.85,42.55 C23.-
  Bottom 0.406: C23.- E5.11
N$57
  Top 0.406: E5.13 32.39,41.27 32.39,53.98 D1.C
N$58
  Top 0.406: D1.A R11.1 C23.+ C22.+
N$59
  Bottom 0.406: D2.C E15.13
N$60
  Top 0.406: 73.03,109.22 71.12,109.22 | 71.12,109.22 R10.1 | 71.12,109.22 D2.A | C24.+ 73.03,118.75 73.03,109.22 | 73.03,109.22 R12.1
N$61
  Bottom 0.406: E15.6 87.63,118.11 100.33,118.11 E16.3
N$63
  Bottom 0.406: D3.C E10.13
N$64
  Top 0.406: R13.1 C25.+ 52.71,90.81 52.71,76.83 R15.E
  Bottom 0.406: D3.A R15.E
N$65  (via drill 0.81)
  Top 0.406: 63.5,88.27 E10.3 | v78.74,123.19 78.74,103.5 63.5,88.27 | 63.5,88.27 E10.4
  Bottom 0.406: E16.8 95.25,123.19 v78.74,123.19
N$66
  Top 0.406: E12.2 E12.3 105.41,87.63 105.41,90.17 E12.5 E12.6 100.33,97.79 100.33,119.38 E16.10
  Bottom 0.406: E9.3 49.53,86.36 50.8,87.63 57.15,87.63 E10.6 67.31,90.17 102.87,90.17 E12.5
PB0  (via drill 0.81)
  Top 0.406: E3.4 82.55,16.51 82.55,9.53 88.27,3.81 v106.68,3.81 | v35.56,31.75 33.02,31.75 v33.02,33.02 | U$7.K1 8.26,29.21 U$2.AK1
  Bottom 0.406: v106.68,3.81 106.68,31.75 v35.56,31.75 | v33.02,33.02 31.12,34.92 29.85,34.92 28.58,33.66 28.58,26.67 22.23,26.67 19.69,29.21 U$7.K1
PB1  (via drill 0.81)
  Top 0.406: v48.9,13.97 43.18,8.26 43.18,6.99 41.28,5.08 38.1,5.08 38.1,22.23 36.2,24.13 24.77,24.13 v24.77,27.94 | U$7.L1 17.78,32.38 8.26,32.38 U$2.AL1
  Bottom 0.406: E3.2 82.55,13.97 v48.9,13.97 | v24.77,27.94 20.96,31.75 U$7.L1
PB2  (via drill 0.81)
  Top 0.406: U$7.M1 8.26,35.56 U$2.AM1 | E6.10 54.61,46.99 v54.61,53.98 | v27.31,52.07 21.59,46.35 v21.59,35.56
  Bottom 0.406: v54.61,53.98 44.45,53.98 42.55,52.07 v27.31,52.07 | U$7.M1 v21.59,35.56
PB3  (via drill 0.81)
  Top 0.406: U$7.N1 15.24,38.1 14.61,38.73 8.26,38.73 U$2.AN1 | v48.9,50.8 46.99,48.9 v46.99,40.64
  Bottom 0.406: v48.9,50.8 E6.8 | v46.99,40.64 45.09,40.64 43.82,39.37 22.23,39.37 20.96,38.1 U$7.N1
PB4  (via drill 0.81)
  Top 0.406: v31.12,29.21 20.32,29.21 U$7.K2
  Bottom 0.406: E3.8 79.38,25.4 81.28,27.3 81.28,29.21 v31.12,29.21 | U$7.K2 17.15,30.48 16.51,29.84 8.26,29.84 U$2.AK2
PB5  (via drill 0.81)
  Top 0.406: E3.10 71.12,25.4 v71.12,30.48 | v32.39,30.48 21.59,30.48 21.59,31.75 U$7.L2
  Bottom 0.406: v32.39,30.48 v71.12,30.48 | U$7.L2 8.26,33.02 U$2.AL2
PB6  (via drill 0.81)
  Top 0.406: E3.12 71.12,10.16 v71.12,6.35 | v40.01,7.62 39.37,8.26 39.37,23.5 36.83,26.04 36.83,32.38 v31.12,38.1
  Bottom 0.406: v71.12,6.35 69.85,5.08 42.55,5.08 v40.01,7.62 | v31.12,38.1 29.85,36.83 U$7.M2 17.15,36.83 16.51,36.2 8.26,36.2 U$2.AM2
PB7  (via drill 0.81)
  Top 0.406: E3.6 81.28,20.32 81.28,9.53 v73.03,1.27 | v21.59,3.81 21.59,20.95 19.05,23.5 19.05,38.1 U$7.N2
  Bottom 0.406: v73.03,1.27 24.13,1.27 v21.59,3.81 | U$7.N2 8.26,39.37 U$2.AN2
PUN_DONE
  Top 0.406: E12.1 102.87,82.55 102.87,87.63 E12.4
  Bottom 0.406: U$2.BH2 8.26,93.34 14.61,93.34 15.24,93.98 U$5.H2 21.59,93.98 21.59,99.69 24.77,102.87 R14.1 50.8,101.6 62.87,101.6 66.68,97.79 84.46,97.79 87,95.25 105.41,95.25 105.41,90.17 E12.4
PUN_FLAG  (via drill 0.81)
  Top 0.406: E12.11 95.25,90.17 95.25,92.71 E12.9 E12.8 | E9.9 40.64,99.06 v40.64,105.41
  Bottom 0.406: v40.64,105.41 77.47,105.41 83.82,99.06 93.98,99.06 E12.8
SYNC_BIAS  (via drill 0.81)
  Top 0.406: R3.1 45.72,76.2 v45.72,119.38 | U$5.U1 8.26,124.46 U$2.BU1
  Bottom 0.406: v45.72,119.38 44.45,120.65 23.5,120.65 19.69,124.46 U$5.U1
SYNC_PUN
  Bottom 0.406: U$2.AV2 8.26,58.42 U$7.V2 26.04,64.14 28.58,64.14 R4.1
SYNC_PUN0
  Top 0.406: R7.2 Q2.1 | U$5.V1 17.78,127.64 8.26,127.64 U$2.BV1
  Bottom 0.406: U$5.V1 36.2,127 40.01,123.19 64.14,123.19 64.77,123.83 70.49,123.83 71.12,123.19 76.84,123.19 81.92,118.11 84.46,118.11 85.73,116.84 E16.11 100.33,113.03 113.03,113.03 113.03,80.64 109.86,77.47 96.52,77.47 88.9,69.85 49.53,69.85 R7.2
VCC
  Top 0.406: E1.14 36.83,8.89 C1.1 | E4.14 97.79,8.89 C4.1 97.79,5.08 106.68,5.08 111.76,10.16 C18.1 111.76,10.79 113.03,12.06 113.03,34.29 111.76,35.56 C19.1 | E2.14 57.15,8.89 C2.1 | E3.14 77.47,8.89 C3.1 | E5.14 36.83,36.83 C5.1 | E9.14 36.83,80.01 C9.1 | R11.2 20.32,60.96 U$5.A2 | E6.14 57.15,36.83 C6.1 60.96,57.15 R1.2 R2.2 R3.2 57.15,72.39 C10.1 57.15,80.01 E10.14 57.15,82.55 R13.2 R14.2 C14.1 57.15,107.95 E14.14 | C7.1 C11.1 77.47,80.01 E11.14 | C8.1 C12.1 97.79,80.01 E12.14 | C15.1 76.2,107.95 E15.14 | C16.1 96.52,107.95 E16.14 | E13.14 36.83,107.95 C13.1
  Bottom 0.406: R5.2 33.02,10.16 E1.14 41.28,10.16 43.82,7.62 C2.1 58.42,8.89 74.93,8.89 | C1.1 25.4,7.62 C17.1 U$7.A2 15.24,5.08 14.61,4.45 8.26,4.45 U$2.AA2 | E3.14 74.93,8.89 | E4.14 95.25,8.89 74.93,8.89 | R11.2 27.94,53.34 C5.1 | C9.1 24.13,78.74 U$5.A2 15.24,74.93 14.61,74.3 8.26,74.3 U$2.BA2 | C19.1 111.76,36.2 111.13,36.83 97.79,36.83 E8.14 95.25,36.83 78.11,36.83 76.84,35.56 E7.14 65.41,35.56 64.14,36.83 57.15,36.83 E6.14 54.61,35.56 53.34,34.29 36.83,34.29 E5.14 | 97.79,82.55 111.13,82.55 111.76,81.92 C21.1 | E12.14 97.79,82.55 | C11.1 81.28,82.55 97.79,82.55 | E16.14 97.79,110.49 111.13,110.49 111.76,109.86 C20.1 | C15.1 78.74,105.41 96.52,105.41 C16.1 | R10.2 R9.2 64.77,102.87 R14.2 | 52.07,110.49 53.34,109.22 E14.14 60.96,109.22 62.23,107.95 74.93,107.95 E15.14 | 52.07,110.49 R8.2 | E13.14 36.83,110.49 52.07,110.49 | E11.14 74.93,82.55 57.15,82.55 E10.14

### Text on the board
Top: M710
Bottom: M710
tNames: V1 | V1 | V1 | V1 | V1 | V1 | V1 | V1 | V1 | V1 | V1 | V1 | V1 | V1 | V1 | V1 | V1 | V1 | V1 | V1 | V1 | V1 | V1 | V1 | V1 | V1 | V1 | V1 | V1 | V1 | V1 | V1 | A1 | A1 | A1 | A1 | A1 | A1 | A1 | A1 | A1 | A1 | A1 | A1 | A1 | A1 | A1 | A1 | A1 | A1 | A1 | A1 | A1 | A1 | A1 | A1 | A1 | A1 | A1 | A1 | A1 | A1 | A1 | A1